# Altium schematic sheet FPGA_Altera_Stratix_III_Dev_Board.SchDoc
size B; SheetNumber: 1
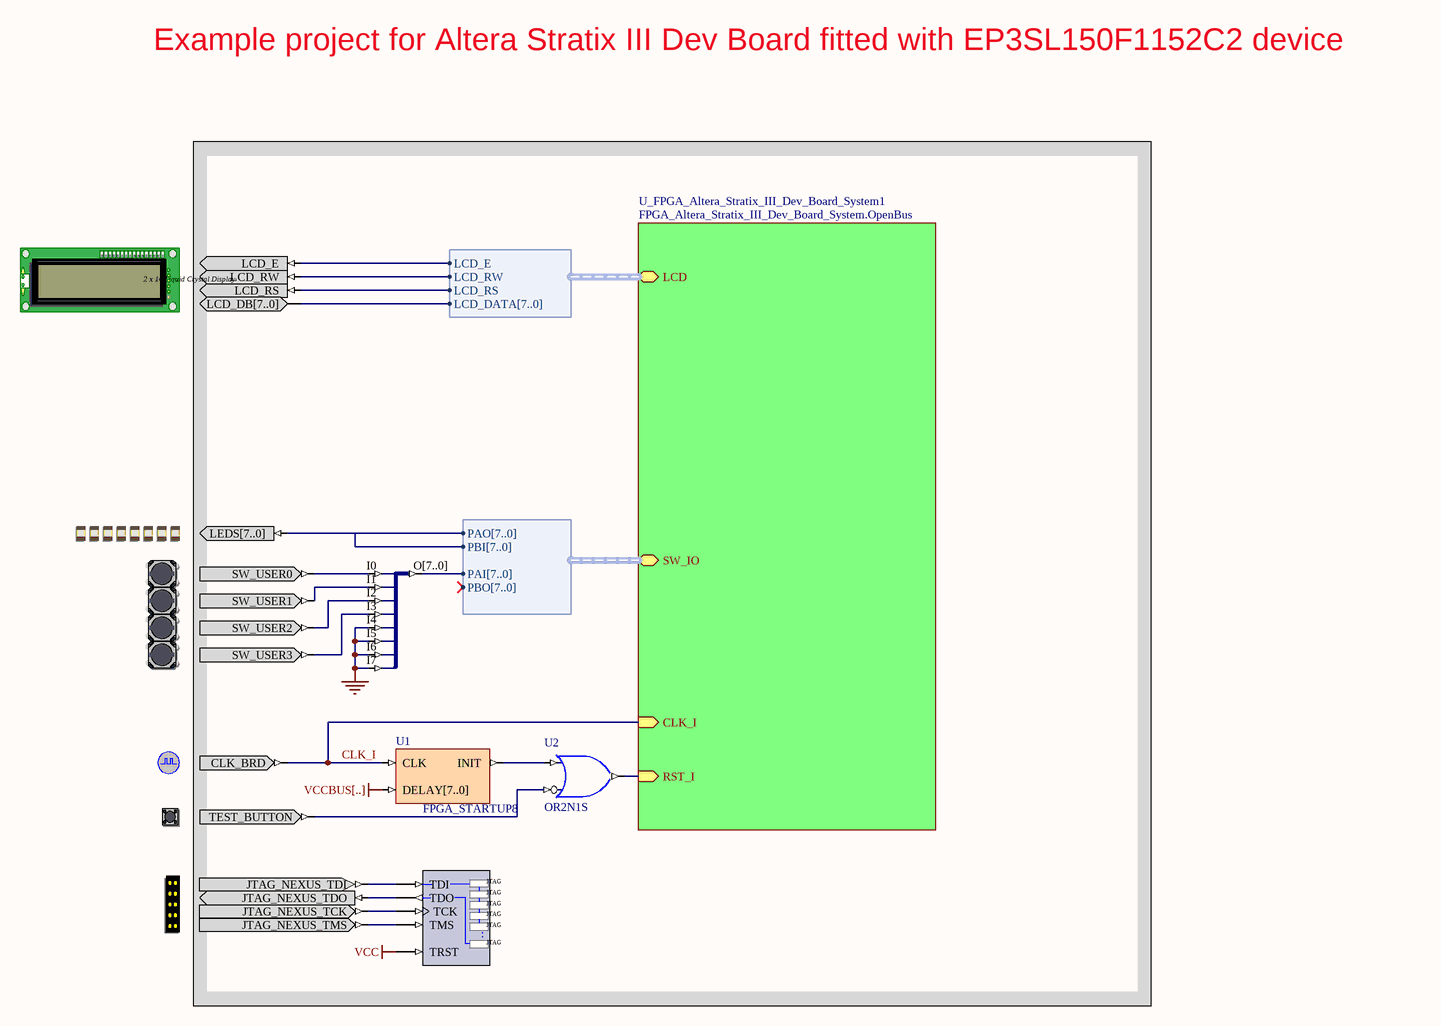
[diagram p0: FPGA_Altera_Stratix_III_Dev_Board.SchDoc]

## Parts
(Parts that share a designator on the sheet are numbered #1, #2 ... from top to bottom, then left to right.)
?#1  LCD  (value not drawn)
?#2  LED  (value not drawn)
?#3  USER_BUTTON0  (value not drawn)
?#4  USER_BUTTON1  (value not drawn)
?#5  USER_BUTTON2  (value not drawn)
?#6  USER_BUTTON3  (value not drawn)
?#7  CLOCK_BOARD  (value not drawn)
?#8  TEST_BUTTON  (value not drawn)
?#9  NEXUS_JTAG_CONNECTOR  (value not drawn)
NEXUS_JTAG_PORT  NEXUS_JTAG_PORT  (value not drawn)
U1  FPGA_STARTUP8
U2  OR2N1S
U17  J8S_8B  (value not drawn)

## Sub-sheets
U_FPGA_Altera_Stratix_III_Dev_Board_System1 = FPGA_Altera_Stratix_III_Dev_Board_System.OpenBus: RST_I (in), CLK_I (in), SW_IO (harness WB_PRTIO_IO_2_8), LCD (harness WB_LCDCTRL)

## Harnesses
WB_LCDCTRL: LCD_DATA[7..0], LCD_E, LCD_RS, LCD_RW
WB_PRTIO_IO_2_8: PAI[7..0], PAO[7..0], PBI[7..0], PBO[7..0]

## Nets
GND: U17.I4 U17.I5 U17.I6 U17.I7
VCC: NEXUS_JTAG_PORT.TRST
VCCBUS[..]: U1.DELAY[7..0]
CLK_I: ?#7.CLK_BRD U1.CLK ; sheet U_FPGA_Altera_Stratix_III_Dev_Board_System1/CLK_I
Net?#1_LCD_DB[7..0]: ?#1.LCD_DB[7..0] ; sheet U_FPGA_Altera_Stratix_III_Dev_Board_System1/LCD.LCD_DATA[7..0]
Net?#1_LCD_E: ?#1.LCD_E ; sheet U_FPGA_Altera_Stratix_III_Dev_Board_System1/LCD.LCD_E
Net?#1_LCD_RS: ?#1.LCD_RS ; sheet U_FPGA_Altera_Stratix_III_Dev_Board_System1/LCD.LCD_RS
Net?#1_LCD_RW: ?#1.LCD_RW ; sheet U_FPGA_Altera_Stratix_III_Dev_Board_System1/LCD.LCD_RW
Net?#2_LEDS[7..0]: ?#2.LEDS[7..0] ; sheet U_FPGA_Altera_Stratix_III_Dev_Board_System1/SW_IO.PAO[7..0], sheet U_FPGA_Altera_Stratix_III_Dev_Board_System1/SW_IO.PBI[7..0]
Net?#3_SW_USER0: ?#3.SW_USER0 U17.I0
Net?#4_SW_USER1: ?#4.SW_USER1 U17.I1
Net?#5_SW_USER2: ?#5.SW_USER2 U17.I2
Net?#6_SW_USER3: ?#6.SW_USER3 U17.I3
Net?#8_TEST_BUTTON: ?#8.TEST_BUTTON U2.I0
Net?#9_JTAG_NEXUS_TCK: ?#9.JTAG_NEXUS_TCK NEXUS_JTAG_PORT.TCK
Net?#9_JTAG_NEXUS_TDI: ?#9.JTAG_NEXUS_TDI NEXUS_JTAG_PORT.TDI
Net?#9_JTAG_NEXUS_TDO: ?#9.JTAG_NEXUS_TDO NEXUS_JTAG_PORT.TDO
Net?#9_JTAG_NEXUS_TMS: ?#9.JTAG_NEXUS_TMS NEXUS_JTAG_PORT.TMS
NetU1_INIT: U1.INIT U2.I1
NetU2_O: U2.O ; sheet U_FPGA_Altera_Stratix_III_Dev_Board_System1/RST_I
NetU17_O[7..0]: U17.O[7..0] ; sheet U_FPGA_Altera_Stratix_III_Dev_Board_System1/SW_IO.PAI[7..0]

## Notes on the sheet
- Example project for Altera Stratix III Dev Board fitted with EP3SL150F1152C2 device
- Title
- Size:
- Date:
- B
- Number:
- Time:
- Revision:
- Sheet
- of
- File:
- (in symbol LCD) 2 x 16 Liquid Crystal Display
- (in symbol NEXUS_JTAG_PORT) .

## Library data of the parts
?#1 = LCD: Liquid Crystal Display; PortComponent: True; Published: 19-Nov-2003; Publisher: Altium Limited; HelpURL: TR0102 NanoBoard Technical Reference Manual - NB1.pdf#page=39
?#2 = LED: Bank of eight Red LEDs; PortComponent: True; Published: 19-Nov-2003; Publisher: Altium Limited; HelpURL: TR0143 NanoBoard Technical Reference Manual - NB2.pdf#page=45
?#3 = USER_BUTTON0: Generic User Button; PortComponent: True; Published: 16-Apr-2007; Publisher: Altium Limited; HelpURL: TR0143 NanoBoard Technical Reference Manual - NB2.pdf#page=47
?#4 = USER_BUTTON1: Generic User Button; PortComponent: True; Published: 16-Apr-2007; Publisher: Altium Limited; HelpURL: TR0143 NanoBoard Technical Reference Manual - NB2.pdf#page=47
?#5 = USER_BUTTON2: Generic User Button; PortComponent: True; Published: 16-Apr-2007; Publisher: Altium Limited; HelpURL: TR0143 NanoBoard Technical Reference Manual - NB2.pdf#page=47
?#6 = USER_BUTTON3: Generic User Button; PortComponent: True; Published: 16-Apr-2007; Publisher: Altium Limited; HelpURL: TR0143 NanoBoard Technical Reference Manual - NB2.pdf#page=47
?#7 = CLOCK_BOARD: Global System Clock Supply; PortComponent: True; Published: 19-Nov-2003; Publisher: Altium Limited; HelpURL: TR0143 Technical Reference Manual for Altium's Desktop NanoBoard NB2DSK01.pdf#page=41; UseInDSF: True
?#8 = TEST_BUTTON: Test / Reset Button; PortComponent: True; Published: 19-Nov-2003; Publisher: Altium Limited; HelpURL: TR0143 Technical Reference Manual for Altium's Desktop NanoBoard NB2DSK01.pdf#page=53
?#9 = NEXUS_JTAG_CONNECTOR: JTAG Port; PortComponent: True; Published: 19-Nov-2003; Publisher: Altium Limited; HelpURL: TR0102 NanoBoard Technical Reference Manual - NB1.pdf#page=33
NEXUS_JTAG_PORT = NEXUS_JTAG_PORT: Soft Nexus-Chain Connector; NEXUS_JTAG_CONNECTOR: True; FunctionalClass: JTAG; Published: 29-Jan-2004; Publisher: Altium Limited; LastRevisionNo: 1.00.00; HelpURL: CR0118 FPGA Generic Library Guide.pdf#page=405
U1 = FPGA_STARTUP8: FPGA Startup With 8 Bit Delay; Published: 9-Dec-2004; Publisher: Altium Limited; HelpURL: CR0119 FPGA_STARTUPx Powerup Delay Unit.pdf; LastRevisionNo: 1.00.00; ComponentLink1Description: Core &Resource Usage; ComponentLink1URL: CR0139 FPGA Peripheral Resource Usage.pdf#page=11
U2 = OR2N1S: 2-Input OR Gate with Active Low A Input, Single Pin Version; XilinxEquivalent: OR2B1; FunctionalClass: Logic Primitive; PortSize: 2; ArchiveName: GENERIC; VHDLIB_SIM: GENERIC_LIB; Published: 29-Jan-2004; Publisher: Altium Limited; LastRevisionNo: 1.00.00; HelpURL: CR0118 FPGA Generic Library Guide.pdf#page=410; ComponentLink1URL: CR0136 FPGA Logic Primitive Resource Usage.pdf#page=187; ComponentLink1Description: Core &Resource Usage; SubClass: OR; PortStyle: Single Pin Version
U17 = J8S_8B: 8 Single pin inputs to single 8-Bit output bus; FunctionalClass: Bus Joiner; PortSize: 8; ArchiveName: GENERIC; VHDLIB_SIM: GENERIC_LIB; Published: 29-Jan-2004; Publisher: Altium Limited; LastRevisionNo: 1.00.00; HelpURL: CR0118 FPGA Generic Library Guide.pdf#page=306; ComponentLink1URL: CR0126 FPGA Bus Joiner Resource Usage.pdf#page=28; ComponentLink1Description: Core &Resource Usage